# EasyEDA Pro project ESP32_wroom_A.eprj, board main
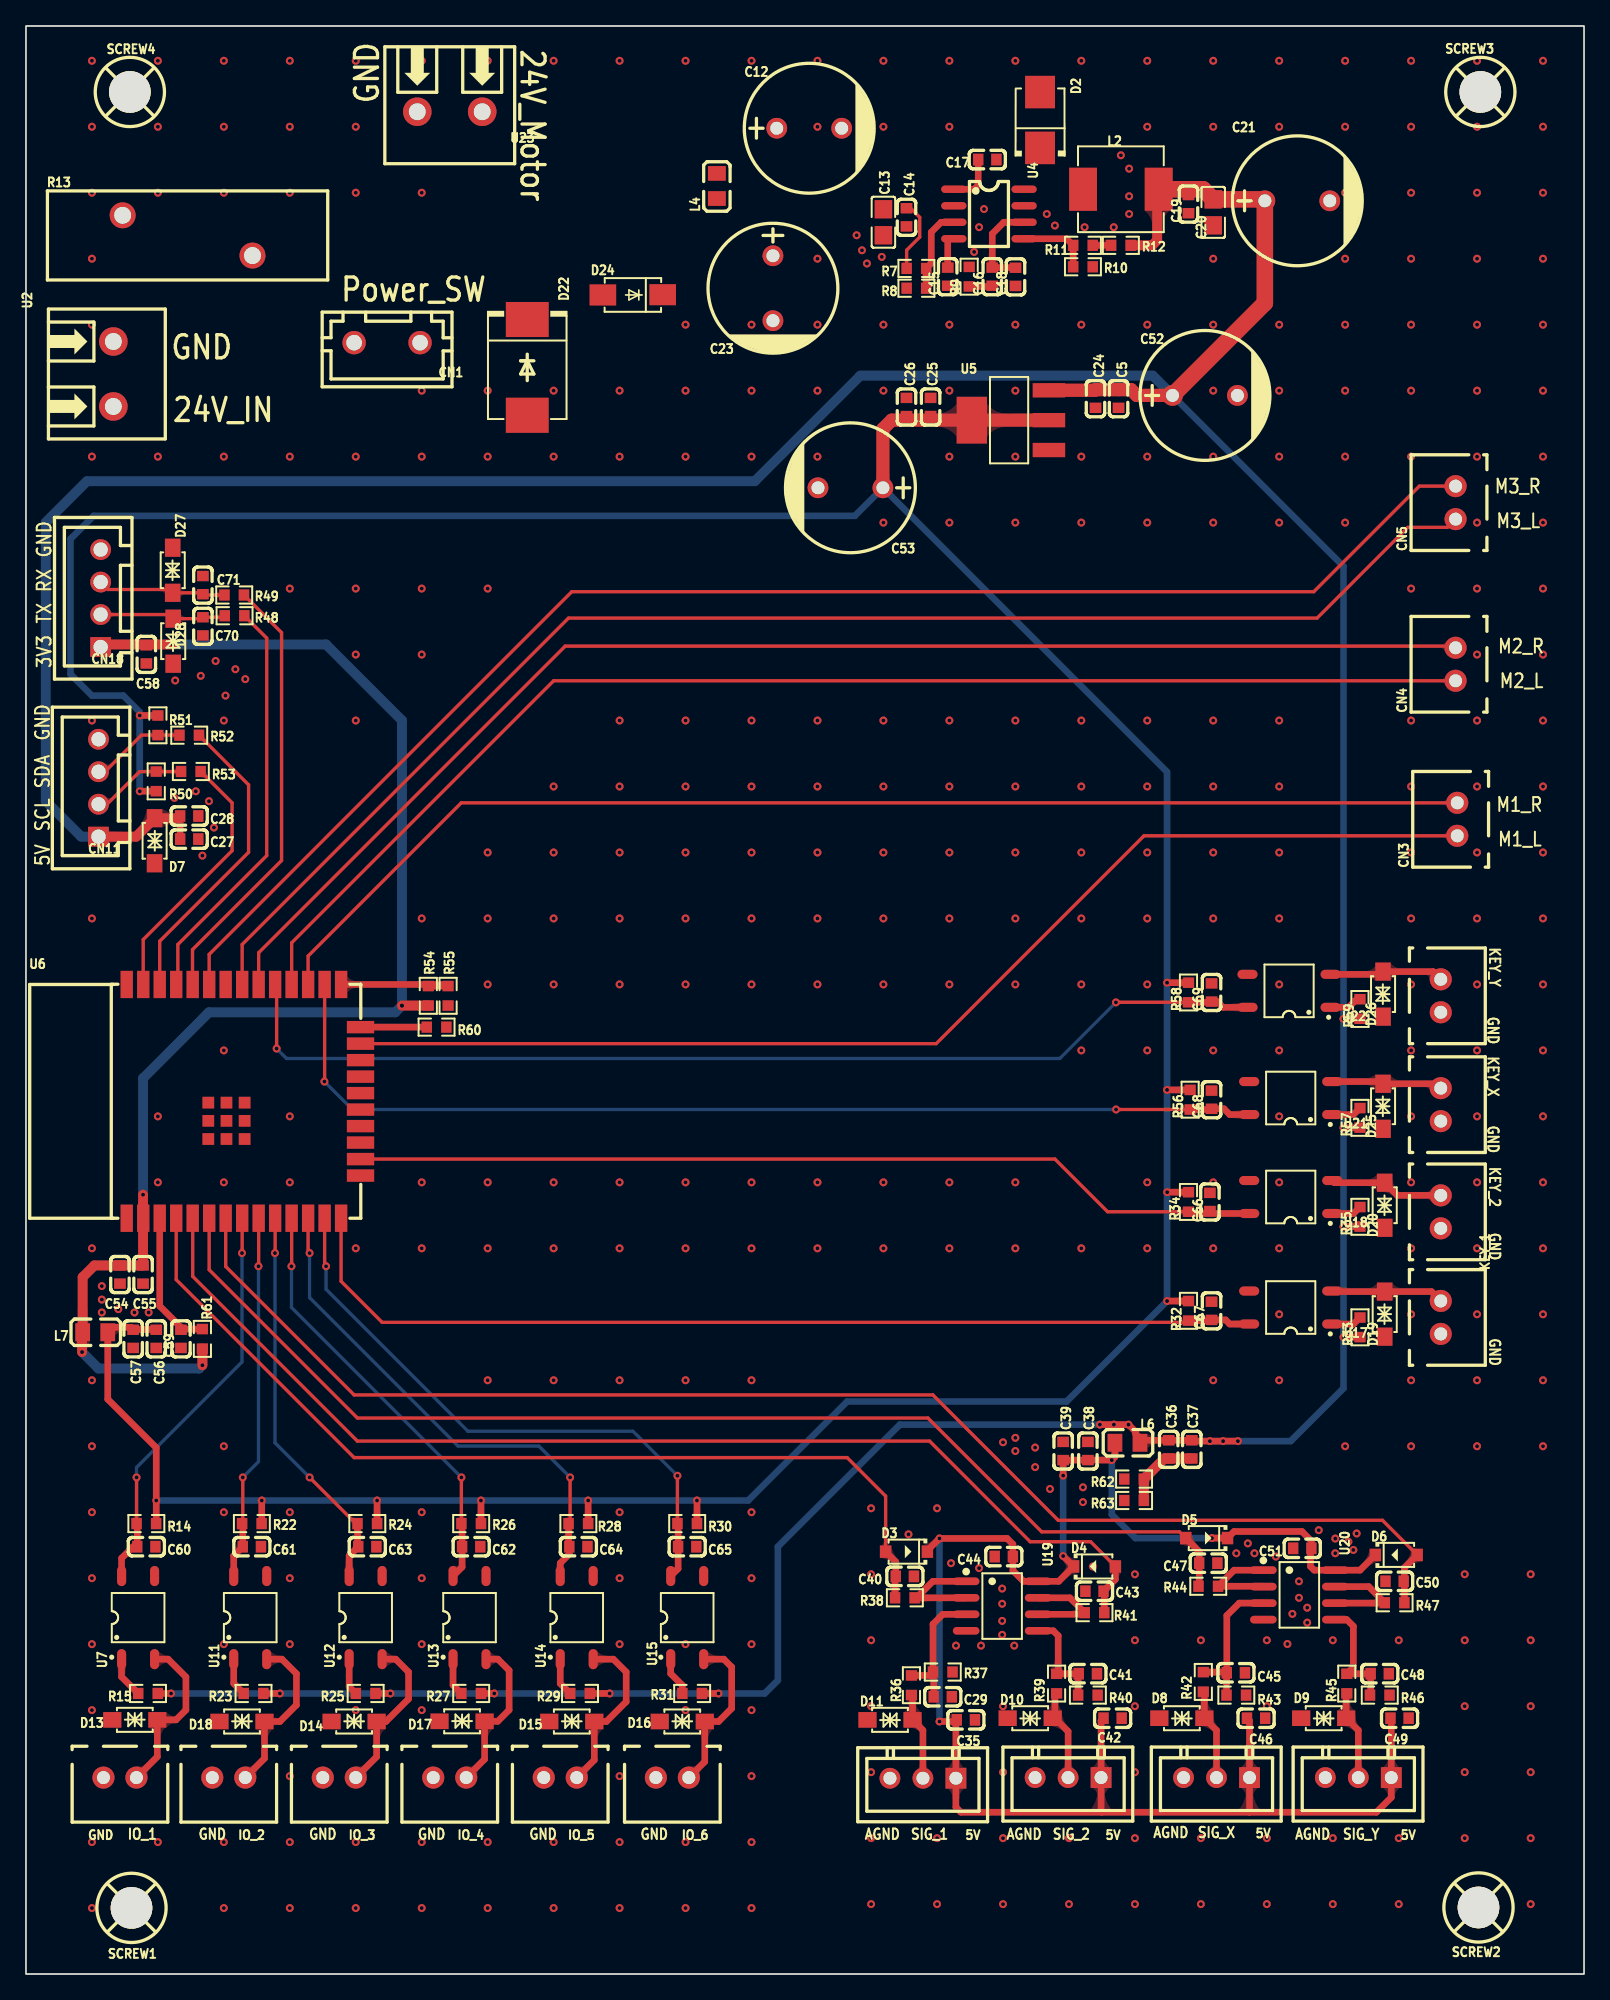
[diagram p1: board, top side]
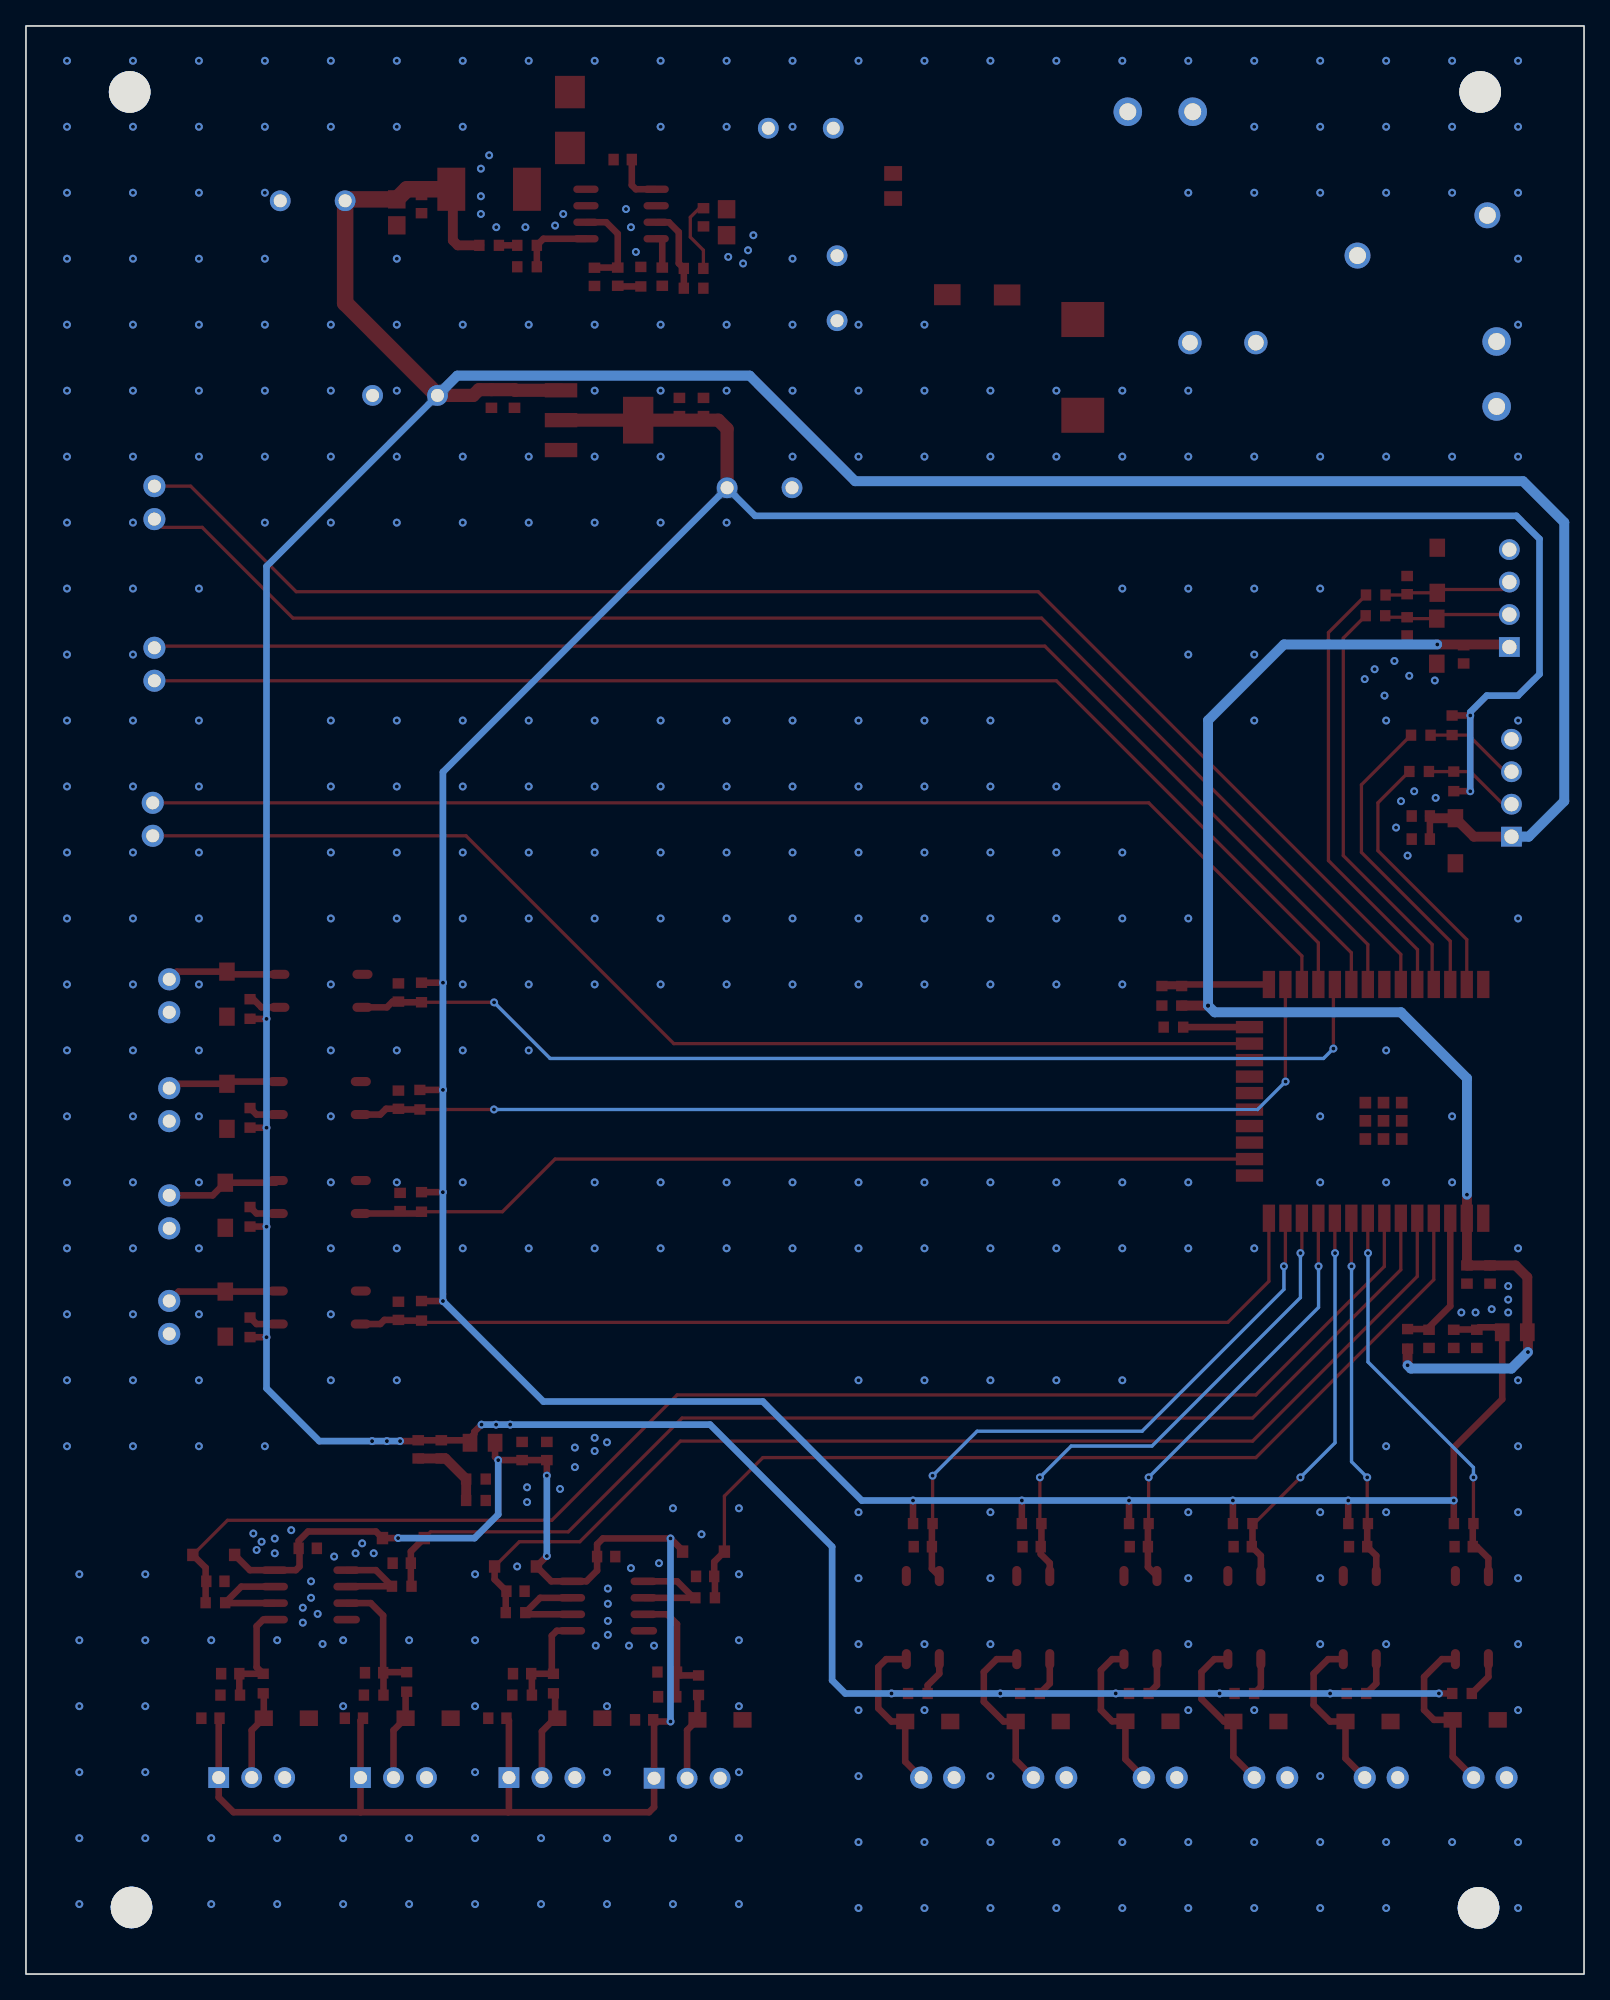
[diagram p2: board, bottom side, seen from below]

Outline 120 x 150 mm; copper layers: Top Layer, Bottom Layer. Coordinates in mm from the lower left corner of the outline.
Outline path: rectangle 0,150 120,0
Stack: Top Layer 0.035mm / Dielectric1 1.51mm FR4 er 4.5 / Bottom Layer 0.035mm

## Design rules (mm)
template: 自定义配置
spacing copperThickness1oz (default): track to track 0.254, other pairs 0 to 0.762
spacing copperThickness2oz: track to track 0.203, other pairs 0.152 to 0.3
track width copperThickness1oz (default): min 0.127, default 0.254, max 2.54
track width copperThickness2oz: min 0.203, default 0.254, max 2.54
differential pair differentialPair (default): width min 0.127, default 0.254, max 2.54; gap min 0.152, default 0.152
via viaSize (default): diameter min 0.5, default 0.61, max 10; hole min 0.3, default 0.305, max 6.299

## Placement (name value [footprint] x y rotation side)
5V  -  [CONN-TH_3P-P2.54_2501S-3P]  69.08 15.08 180 top
5V#2  -  [CONN-TH_3P-P2.54_2501S-3P]  80.26 15.13 180 top
5V#3  -  [CONN-TH_3P-P2.54_2501S-3P]  91.69 15.13 180 top
5V#4  -  [CONN-TH_3P-P2.54_2501S-3P]  102.62 15.13 180 top
C5  100nF  [C0603]  84.15 121.3 90 top
C12  470uF  [CAP-TH_BD10.0-P5.00-D0.6-FD-A]  60.33 142.13 0 top
C13  10uF  [C0805]  66.04 134.89 90 top
C14  100nF  [C0603]  67.82 135.27 90 top
C15  10nF  [C0603]  70.99 130.7 90 top
C16  1nF  [C0603]  74.42 130.7 90 top
C17  100nF  [C0603]  74.04 139.71 0 top
C18  100pF  [C0603]  76.21 130.68 90 top
C19  100nF  [C0603]  89.54 136.28 90 top
C20  10uF  [C0805]  91.44 135.65 90 top
C21  470uF  [CAP-TH_BD10.0-P5.00-D0.6-FD-A]  97.92 136.54 0 top
C23  470uF  [CAP-TH_BD10.0-P5.00-D0.6-FD-A]  57.53 129.81 270 top
C24  10uF  [C0603]  82.37 121.3 90 top
C25  100nF  [C0603]  69.67 120.66 270 top
C26  10uF  [C0603]  67.82 120.66 270 top
C27  100nF  [C0603]  12.57 87.39 180 top
C28  10uF  [C0603]  12.57 89.17 180 top
C29  100nF  [C0603]  70.61 21.35 180 top
C35  100nF  [C0603]  72.39 19.57 180 top
C36  100nF  [C0603]  88.01 40.4 90 top
C37  10uF  [C0603]  89.79 40.4 90 top
C38  100nF  [C0603]  81.79 40.27 270 top
C39  10uF  [C0603]  79.88 40.27 270 top
C40  100nF  [C0603]  67.69 30.62 180 top
C41  100nF  [C0603]  81.79 23.13 180 top
C42  100nF  [C0603]  83.69 19.7 180 top
C43  100nF  [C0603]  82.3 29.48 0 top
C44  100nF  [C0603]  75.31 32.14 0 top
C45  100nF  [C0603]  93.19 23.2 180 top
C46  100nF  [C0603]  94.74 19.7 180 top
C47  100nF  [C0603]  91.06 31.64 180 top
C48  100nF  [C0603]  104.27 23.13 180 top
C49  100nF  [C0603]  105.79 19.7 180 top
C50  100nF  [C0603]  105.41 30.24 0 top
C51  100nF  [C0603]  98.3 32.78 0 top
C52  220uF  [CAP-TH_BD10.0-P5.00-D0.6-FD-A]  90.8 121.55 0 top
C53  220uF  [CAP-TH_BD10.0-P5.00-D0.6-FD-A]  63.5 114.44 180 top
C54  4.7uF  [C0603]  7.24 53.86 90 top
C55  100nF  [C0603]  9.02 53.86 90 top
C56  100nF  [C0603]  10.03 48.91 90 top
C57  4.7uF  [C0603]  8.26 48.91 90 top
C58  100nF  [C0603]  9.27 101.61 270 top
C59  100nF  [C0603]  11.94 48.91 90 top
C60  100nF  [C0603]  9.27 32.91 180 top
C61  100nF  [C0603]  17.4 32.91 180 top
C62  100nF  [C0603]  34.29 32.91 180 top
C63  100nF  [C0603]  26.29 32.91 180 top
C64  100nF  [C0603]  42.55 32.91 180 top
C65  100nF  [C0603]  50.93 32.91 180 top
C66  100nF  [C0603]  91.19 59.45 270 top
C67  100nF  [C0603]  91.31 51.07 270 top
C68  100nF  [C0603]  91.31 67.32 270 top
C69  100nF  [C0603]  91.31 75.58 270 top
C70  N.C  [C0603]  13.63 103.77 90 top
C71  N.C  [C0603]  13.63 106.95 90 top
CN1  B2(3)B-XH-A(LF)(SN)  [CONN-TH_2P-V-P5.00-R_B2-3B-XH-A-LF-SN]  27.81 125.62 180 top
CN3  B2B-XH-A(LF)(SN)  [CONN-TH_B2B-XH-A-LF-SN]  110.24 88.91 90 top
CN4  B2B-XH-A(LF)(SN)  [CONN-TH_B2B-XH-A-LF-SN]  110.11 100.85 90 top
CN5  B2B-XH-A(LF)(SN)  [CONN-TH_B2B-XH-A-LF-SN]  110.11 113.3 90 top
CN11  ZX-XH2.54-4PZZ  [CONN-TH_4P-P2.50_4PIN]  5.59 91.33 90 top
CN13  B2B-XH-A(LF)(SN)  [CONN-TH_B2B-XH-A-LF-SN]  108.97 58.69 270 top
CN18  ZX-XH2.54-4PZZ  [CONN-TH_4P-P2.50_4PIN]  5.75 105.93 90 top
CN19  B2B-XH-A(LF)(SN)  [CONN-TH_B2B-XH-A-LF-SN]  108.97 66.94 270 top
CN20  B2B-XH-A(LF)(SN)  [CONN-TH_B2B-XH-A-LF-SN]  108.97 75.32 270 top
D2  SS1060B  [SMB_L4.3-W3.6-LS5.3-RD]  78.11 142.76 90 top
D3  1N4148W  [SOD-123_L2.7-W1.6-LS3.7-FD]  67.82 32.53 0 top
D4  1N4148W  [SOD-123_L2.7-W1.6-LS3.7-FD]  82.3 31.38 180 top
D5  1N4148W  [SOD-123_L2.7-W1.6-LS3.7-FD]  90.93 33.57 0 top
D6  1N4148W  [SOD-123_L2.7-W1.6-LS3.7-FD]  105.54 32.27 180 top
D7  SMF24CA  [SOD-123FL_L2.7-W1.8-LS3.8-BI]  9.91 87.26 90 top
D8  SMF24CA  [SOD-123FL_L2.7-W1.8-LS3.8-BI]  89.03 19.7 0 top
D9  SMF24CA  [SOD-123FL_L2.7-W1.8-LS3.8-BI]  99.95 19.7 0 top
D10  SMF24CA  [SOD-123FL_L2.7-W1.8-LS3.8-BI]  77.34 19.7 0 top
D11  SMF24CA  [SOD-123FL_L2.7-W1.8-LS3.8-BI]  66.55 19.57 0 top
D13  SMF24CA  [SOD-123FL_L2.7-W1.8-LS3.8-BI]  8.38 19.57 180 top
D14  SMF24CA  [SOD-123FL_L2.7-W1.8-LS3.8-BI]  25.27 19.44 180 top
D15  SMF24CA  [SOD-123FL_L2.7-W1.8-LS3.8-BI]  42.04 19.44 180 top
D16  SMF24CA  [SOD-123FL_L2.7-W1.8-LS3.8-BI]  50.55 19.44 180 top
D17  SMF24CA  [SOD-123FL_L2.7-W1.8-LS3.8-BI]  33.59 19.46 180 top
D18  SMF24CA  [SOD-123FL_L2.7-W1.8-LS3.8-BI]  16.64 19.44 180 top
D19  SMF24CA  [SOD-123FL_L2.7-W1.8-LS3.8-BI]  104.65 50.81 270 top
D20  SMF24CA  [SOD-123FL_L2.7-W1.8-LS3.8-BI]  104.65 59.2 270 top
D22  SMCJ24A  [SMC_L6.9-W5.9-LS7.9-RD]  38.61 123.71 270 top
D24  SS54  [SMA_L4.3-W2.6-LS5.0-FD]  46.74 129.3 0 top
D25  SMF24CA  [SOD-123FL_L2.7-W1.8-LS3.8-BI]  104.52 66.82 270 top
D26  SMF24CA  [SOD-123FL_L2.7-W1.8-LS3.8-BI]  104.52 75.45 270 top
D27  SMF24CA  [SOD-123FL_L2.7-W1.8-LS3.8-BI]  11.3 108.09 270 top
D28  SMF24CA  [SOD-123FL_L2.7-W1.8-LS3.8-BI]  11.34 102.63 270 top
GND  B2B-XH-A(LF)(SN)  [CONN-TH_B2B-XH-A-LF-SN]  7.24 15.13 180 top
IO_2  B2B-XH-A(LF)(SN)  [CONN-TH_B2B-XH-A-LF-SN]  15.62 15.13 180 top
IO_3  B2B-XH-A(LF)(SN)  [CONN-TH_B2B-XH-A-LF-SN]  24.13 15.13 180 top
IO_4  B2B-XH-A(LF)(SN)  [CONN-TH_B2B-XH-A-LF-SN]  32.64 15.13 180 top
IO_5  B2B-XH-A(LF)(SN)  [CONN-TH_B2B-XH-A-LF-SN]  41.15 15.13 180 top
IO_6  B2B-XH-A(LF)(SN)  [CONN-TH_B2B-XH-A-LF-SN]  49.78 15.13 180 top
KEY_1  B2B-XH-A(LF)(SN)  [CONN-TH_B2B-XH-A-LF-SN]  108.97 50.56 270 top
L2  10uH  [IND-SMD_L7.1-W6.6]  84.33 137.43 0 top
L4  GZ2012D101TF  [L0805]  53.21 137.68 90 top
L6  GZ2012D101TF  [L0805]  84.84 40.91 180 top
L7  GZ2012D101TF  [L0805]  5.33 49.42 180 top
R7  12kΩ  [R0603]  68.58 131.33 180 top
R8  2.7kΩ  [R0603]  68.58 129.81 0 top
R9  22kΩ  [R0603]  72.64 130.7 270 top
R10  2kΩ  [R0603]  81.41 131.46 180 top
R11  10kΩ  [R0603]  81.41 133.11 0 top
R12  510R  [R0603]  84.33 133.11 0 top
R13  1.05nF@1kHz  [RES-TH_L21.5-W6.8-P10.00-D1.0-S3.10]  12.45 133.87 0 top
R14  2kΩ  [R0603]  9.27 34.68 0 top
R15  680Ω  [R0603]  9.4 21.6 0 top
R22  2kΩ  [R0603]  17.4 34.68 0 top
R23  680Ω  [R0603]  17.53 21.6 0 top
R24  2kΩ  [R0603]  26.29 34.68 0 top
R25  680Ω  [R0603]  26.16 21.6 0 top
R26  2kΩ  [R0603]  34.29 34.68 0 top
R27  680Ω  [R0603]  34.29 21.6 0 top
R28  2kΩ  [R0603]  42.55 34.68 0 top
R29  680Ω  [R0603]  42.67 21.6 0 top
R30  2kΩ  [R0603]  50.93 34.68 0 top
R31  680Ω  [R0603]  51.31 21.6 0 top
R32  2kΩ  [R0603]  89.54 51.07 90 top
R33  680Ω  [R0603]  102.74 49.8 270 top
R34  2kΩ  [R0603]  89.54 59.45 90 top
R35  680Ω  [R0603]  102.74 58.31 270 top
R36  4.7kΩ  [R0603]  68.2 22.24 90 top
R37  10kΩ  [R0603]  70.61 23.25 180 top
R38  1kΩ  [R0603]  67.69 28.97 180 top
R39  4.7kΩ  [R0603]  79.38 22.37 90 top
R40  10kΩ  [R0603]  81.79 21.48 180 top
R41  1kΩ  [R0603]  82.3 27.83 0 top
R42  6.8kΩ  [R0603]  90.68 22.49 90 top
R43  10kΩ  [R0603]  93.22 21.48 180 top
R44  1kΩ  [R0603]  91.06 29.86 180 top
R45  6.8kΩ  [R0603]  101.73 22.37 90 top
R46  10kΩ  [R0603]  104.27 21.48 180 top
R47  1kΩ  [R0603]  105.41 28.59 0 top
R48  33Ω  [R0603]  16.06 104.59 180 top
R49  33Ω  [R0603]  16.04 106.19 180 top
R50  10kΩ  [R0603]  10.03 91.83 270 top
R51  10kΩ  [R0603]  10.16 96.15 90 top
R52  33Ω  [R0603]  12.57 95.39 180 top
R53  33Ω  [R0603]  12.7 92.6 180 top
R54  N.C  [R0603]  30.99 75.32 270 top
R55  N.C  [R0603]  32.51 75.32 90 top
R56  2kΩ  [R0603]  89.66 67.32 90 top
R57  680Ω  [R0603]  102.74 65.93 270 top
R58  2kΩ  [R0603]  89.54 75.58 90 top
R59  680Ω  [R0603]  102.74 74.31 270 top
R60  N.C  [R0603]  31.62 72.91 180 top
R61  10kΩ  [R0603]  13.59 48.91 270 top
R62  0Ω  [R0603]  85.34 38.11 180 top
R63  0Ω  [R0603]  85.34 36.46 180 top
SCREW1  -  [M3螺丝]  8.13 5.09 0 top
SCREW2  -  [M3螺丝]  111.87 5.12 0 top
SCREW3  -  [M3螺丝]  112.01 144.92 0 top
SCREW4  -  [M3螺丝]  8 144.92 0 top
U2  1935161  [CONN-TH_2P-P5.00_1935161]  6.73 123.2 270 top
U4  TPS54331DR  [SOIC-8_L5.0-W4.0-P1.27-LS6.0-BL]  74.17 135.52 270 top
U5  AMS1117-3.3  [SOT-223-3_L6.5-W3.4-P2.30-LS7.0-BR]  75.82 119.65 0 top
U6  ESP32-WROOM-32E-N4  [WIFI-SMD_ESP32-WROOM-32E]  16.76 67.2 0 top
U7  LTV-357T-C  [SOP-4_L4.4-W3.9-P2.54-LS7.0-TL]  8.64 27.45 90 top
U11  LTV-357T-C  [SOP-4_L4.4-W3.9-P2.54-LS7.0-TL]  17.27 27.45 90 top
U12  LTV-357T-C  [SOP-4_L4.4-W3.9-P2.54-LS7.0-TL]  26.16 27.45 90 top
U13  LTV-357T-C  [SOP-4_L4.4-W3.9-P2.54-LS7.0-TL]  34.16 27.45 90 top
U14  LTV-357T-C  [SOP-4_L4.4-W3.9-P2.54-LS7.0-TL]  42.42 27.45 90 top
U15  LTV-357T-C  [SOP-4_L4.4-W3.9-P2.54-LS7.0-TL]  50.93 27.45 90 top
U17  LTV-357T-C  [SOP-4_L4.4-W3.9-P2.54-LS7.0-TL]  97.41 51.32 180 top
U18  LTV-357T-C  [SOP-4_L4.4-W3.9-P2.54-LS7.0-TL]  97.41 59.83 180 top
U19  LM2904DR  [SOIC-8_L4.9-W3.9-P1.27-LS6.0-BL]  75.18 28.33 270 top
U20  LM2904DR  [SOIC-8_L4.9-W3.9-P1.27-LS6.0-BL]  98.07 29.19 270 top
U21  LTV-357T-C  [SOP-4_L4.4-W3.9-P2.54-LS7.0-TL]  97.41 67.45 180 top
U22  LTV-357T-C  [SOP-4_L4.4-W3.9-P2.54-LS7.0-TL]  97.28 75.71 180 top
U23  1935161  [CONN-TH_2P-P5.00_1935161]  32.64 143.4 180 top

## Footprints (pads in the part's own frame, mm; a bottom-side part is the same pattern mirrored in y, then rotated)
C0603
  rect 0.8x0.9 smd: 1(-0.7,0) 2(0.7,0)
C0805
  rect 1.41x1.35 smd: 1(-1,0) 2(1,0)
CAP-TH_BD10.0-P5.00-D0.6-FD-A
  round 1.6 hole 1: 1(-2.5,0) 2(2.5,0)
CONN-TH_2P-P5.00_1935161
  round 2.2 hole 1.3: 1(-2.5,0) 2(2.5,0)
CONN-TH_2P-V-P5.00-R_B2-3B-XH-A-LF-SN
  round 1.8 hole 1.2: 1(2.54,0) 2(-2.54,0)
CONN-TH_3P-P2.54_2501S-3P
  rect 1.6x1.6 hole 1: 1(-2.54,0)
  round 1.6 hole 1: 2(0,0) 3(2.54,0)
CONN-TH_4P-P2.50_4PIN
  rect 1.524x1.6 hole 1.1: 1(-3.75,0)
  round 1.6 hole 1.1: 2(-1.25,0) 3(1.25,0) 4(3.75,0)
CONN-TH_B2B-XH-A-LF-SN
  round 1.7 hole 1: 1(1.27,0) 2(-1.27,0)
IND-SMD_L7.1-W6.6
  rect 2.15x3.32 smd: 1(-2.913,0) 2(2.913,0)
L0805
  rect 1.133x1.377 smd: 1(-0.966,0) 2(0.966,0)
M3螺丝
  round 3.2 hole 3.2: 1(0,0)
R0603
  rect 0.806x0.864 smd: 1(-0.753,0) 2(0.753,0)
RES-TH_L21.5-W6.8-P10.00-D1.0-S3.10
  round 2 hole 1.3: 1(-5,1.55) 2(5,-1.55)
SMA_L4.3-W2.6-LS5.0-FD
  rect 2.046x1.62 smd: 1(-2.304,-0.009) 2(2.304,0.009)
SMB_L4.3-W3.6-LS5.3-RD
  rect 2.5x2.3 smd: 1(-2.15,0) 2(2.15,0)
SMC_L6.9-W5.9-LS7.9-RD
  rect 2.7x3.3 smd: 1(-3.687,0) 2(3.687,0)
SOD-123_L2.7-W1.6-LS3.7-FD
  rect 0.88x0.96 smd: 1(-1.61,0) 2(1.61,0)
SOD-123FL_L2.7-W1.8-LS3.8-BI
  rect 1.4x1.2 smd: 1(-1.735,0) 2(1.735,0)
SOIC-8_L4.9-W3.9-P1.27-LS6.0-BL
  oval 0.588x2.045 smd: 1(-1.905,-2.772) 2(-0.635,-2.772) 3(0.635,-2.772) 4(1.905,-2.772) 5(1.905,2.772) 6(0.635,2.772) 7(-0.635,2.772) 8(-1.905,2.772)
SOIC-8_L5.0-W4.0-P1.27-LS6.0-BL
  oval 0.569x1.95 smd: 1(-1.905,-2.705) 2(-0.635,-2.705) 3(0.635,-2.705) 4(1.905,-2.705) 5(1.905,2.705) 6(0.635,2.705) 7(-0.635,2.705) 8(-1.905,2.705)
SOP-4_L4.4-W3.9-P2.54-LS7.0-TL
  oval 1.55x0.7 smd: 1(-3.2,1.27) 2(-3.2,-1.27) 3(3.2,-1.27) 4(3.2,1.27)
SOT-223-3_L6.5-W3.4-P2.30-LS7.0-BR
  rect 2.5x1.1 smd: 1(2.97,-2.3) 2(2.97,0) 3(2.97,2.3)
  rect 2.34x3.6 smd: 4(-2.97,0)
WIFI-SMD_ESP32-WROOM-32E
  rect 0.95x2.1 smd: 1(-9.002,-9) 2(-7.732,-9) 3(-6.463,-9) 4(-5.192,-9) 5(-3.922,-9) 6(-2.652,-9) 7(-1.383,-9) 8(-0.113,-9) 9(1.157,-9) 10(2.428,-9) 11(3.697,-9) 12(4.968,-9) 13(6.237,-9) 14(7.508,-9) 25(7.508,9) 26(6.237,9) 27(4.968,9) 28(3.697,9) 29(2.428,9) 30(1.157,9) 31(-0.113,9) 32(-1.383,9) 33(-2.652,9) 34(-3.922,9) 35(-5.192,9) 36(-6.463,9) 37(-7.732,9) 38(-9.002,9)
  rect 2.1x0.95 smd: 15(9.002,-5.715) 16(9.002,-4.445) 17(9.002,-3.175) 18(9.002,-1.905) 19(9.002,-0.635) 20(9.002,0.635) 21(9.002,1.905) 22(9.002,3.175) 23(9.002,4.445) 24(9.002,5.715)
  rect 0.9x0.9 smd: 39(-2.721,-0.1) 39(-2.721,-1.5) 39(-2.721,-2.9) 39(-1.321,-0.1) 39(-1.321,-1.5) 39(-1.321,-2.9) 39(0.079,-0.1) 39(0.079,-1.5) 39(0.079,-2.9)

## Nets
As in the schematic, except:
AGND: 5V.3 5V#2.3 5V#3.3 5V#4.3 C29.1 C35.1 C38.1 C39.1 C40.1 C41.1 C42.1 C43.1 C44.1 C45.1 C46.1 C47.1 C48.1 C49.1 C50.1 C51.1 D8.1 D9.1 D10.1 D11.1 R37.1 R40.1 R43.1 R46.1 R62.2 R63.2 U19.4 U20.4
GND: C5.1 C12.2 C13.1 C14.1 C15.1 C18.1 C19.1 C20.1 C21.2 C23.2 C24.1 C25.1 C26.1 C27.1 C28.1 C36.1 C37.1 C52.2 C53.2 C54.1 C55.1 C56.1 C57.1 C58.2 C59.1 C60.1 C61.1 C62.1 C63.1 C64.1 C65.1 C66.1 C67.1 C68.1 C69.1 C70.1 C71.2 CN11.4 CN13.1 CN18.4 CN19.1 CN20.1 D2.2 D7.1 D13.2 D14.2 D15.2 D16.2 D17.2 D18.2 D19.2 D20.2 D22.2 D25.2 D26.2 D27.1 D28.2 GND.1 IO_2.1 IO_3.1 IO_4.1 IO_5.1 IO_6.1 KEY_1.1 R8.1 R9.1 R10.1 R13.1 R55.1 R60.1 R62.1 R63.1 U2.1 U4.7 U5.1 U6.1 U6.15 U6.38 U6.39 U7.3 U11.3 U12.3 U13.3 U14.3 U15.3 U17.3 U18.3 U21.3 U22.3 U23.2
A_5V: 5V.1 5V#2.1 5V#3.1 5V#4.1 C35.2 C38.2 C39.2 C42.2 C44.2 C46.2 C49.2 C51.2 D3.2 D4.2 D5.2 D6.2 L6.2 U19.8 U20.8
$1N8302: D13.1 GND.2 U7.2
$1N9716: D18.1 IO_2.2 U11.2
$1N9950: D14.1 IO_3.2 U12.2
$1N10184: D17.1 IO_4.2 U13.2
$1N10418: D15.1 IO_5.2 U14.2
$1N10652: D16.1 IO_6.2 U15.2
$1N11851: D19.1 KEY_1.2 U17.2
$1N12794: 5V.2 D11.2 R36.1
$1N14080: 5V#2.2 D10.2 R39.1
$1N15273: 5V#3.2 D8.2 R42.1
$1N15305: 5V#4.2 D9.2 R45.1

Pads without a net: SCREW1 1; SCREW2 1; SCREW3 1; SCREW4 1; U6 17 18 19 20 21 22 32

## Via types
v1: diameter 0.61, hole 0.305, Top Layer to Bottom Layer, 122 vias
v2: diameter 0.61, hole 0.304, Top Layer to Bottom Layer, 377 vias

## Routing (per net, layer and track width the routed paths; a pad name or vN(x,y) marks a point on that pad's centre or on a via; arc(x,y) is an arc through that point)
+3.3V: length 299.1
  Top Layer w0.508: R14.2 10.03,34.69 v1(10.03,36.46) 10.03,40.53 6.3,44.26 6.3,49.29 6.81,49.8 8.08,49.8 8.25,49.63 9.99,49.63 10.01,49.65 ; R22.2 18.16,34.69 v1(18.16,36.46) ; R26.2 v1(35.04,36.46) ; v1(8.76,91.07) 8.77,91.08 R50.2 ; R24.2 v1(27.04,36.46) ; R30.2 v1(51.68,36.46) ; R34.2 v1(87.89,60.2) 87.88,60.21 ; R28.2 v1(43.3,36.46) ; R56.2 v1(87.88,68.08) ; R58.2 v1(87.88,76.33) ; R32.2 v1(87.88,51.82) ; R51.2 v1(8.76,96.91)
  Top Layer w1.016: U5.2 U5.4 66.67,119.65 66,118.97 66,114.57
  Bottom Layer w0.508: v1(8.76,91.07) v1(8.76,96.91) 8.76,97.17 7.49,98.44 5.08,98.44 3.43,100.09 3.43,110.5 5.21,112.28 63.84,112.28 C53.1 87.88,92.56 v1(87.88,76.33) v1(87.88,68.08) v1(87.88,51.82) 80.15,44.08 63.25,44.08 55.63,36.46 v1(51.68,36.46) v1(43.3,36.46) v1(35.04,36.46) v1(27.04,36.46) v1(18.16,36.46) v1(10.03,36.46)
+3.3V_MCU: length 108.4
  Top Layer w0.762: v1(4.32,47.89) 4.32,49.37 L7.2 4.37,53.66 5.27,54.56 C54.2 C55.2 9.02,58.18 ; R54.2 v1(28.96,74.57) ; 9.02,58.18 U6.2 ; 9.02,58.18 v1(9.02,60.01) ; v1(13.59,46.88) R61.2 ; CN18.1 5.95,102.38 v1(11.3,102.38)
  Bottom Layer w0.762: v1(9.02,60.01) 9.02,68.97 14.1,74.05 28.45,74.05 v1(28.96,74.56) 28.96,96.53 23.11,102.38 v1(11.3,102.38) ; v1(13.59,46.88) 13.34,46.62 5.59,46.62 v1(4.32,47.89)
+5V: length 375.3
  Top Layer w0.508: R27.2 v1(36.07,21.6) ; R35.2 101.48,57.55 v1(101.47,57.54) ; R15.2 v1(11.18,21.6) ; C28.2 C27.2 ; R33.2 102.73,49.04 v1(101.47,49.04) ; 85.98,41.08 L6.1 ; 85.98,41.08 85.99,41.1 C36.2 C37.2 89.85,41.03 v1(91.19,41.03) v1(92.2,41.03) v1(93.35,41.03) ; 85.98,41.08 85.47,41.59 85.47,41.75 v1(84.92,42.3) v1(83.79,42.3) 82.88,42.3 ; R31.2 v1(53.34,21.6) ; R25.2 v1(28.07,21.6) ; R57.2 102.73,65.16 v1(101.47,65.16) ; v1(101.47,73.55) 102.48,73.55 102.62,73.68 ; R23.2 v1(19.56,21.6) ; 87.11,137.56 L2.2 ; R29.2 v1(44.96,21.6)
  Top Layer w0.762: CN11.1 8.48,87.58 D7.2 11.7,89 C28.2 ; R12.2 86.74,133.11 87.12,133.49 87.12,137.05
  Top Layer w1.016: U5.3 82.32,121.95 C24.2 C5.2 85.11,122 85.56,121.55 C52.1
  Top Layer w1.27: L2.2 90.66,137.43 C20.2 95.31,136.65 C21.1 95.42,128.66 C52.1
  Bottom Layer w0.508: 84.71,42.3 v1(83.79,42.3) v1(82.71,42.3) 67.31,42.3 57.91,32.91 57.91,22.62 56.9,21.6 v1(53.34,21.6) v1(44.96,21.6) v1(36.07,21.6) v1(28.07,21.6) v1(19.56,21.6) v1(11.18,21.6) ; v1(91.19,41.03) v1(92.2,41.03) v1(93.35,41.03) 97.41,41.03 101.47,45.1 v1(101.47,49.04) v1(101.47,57.54) v1(101.47,65.16) v1(101.47,73.55) 101.47,108.38 C52.1
  Bottom Layer w0.762: CN11.1 4.26,87.58 1.52,90.31 1.52,111.77 4.7,114.95 56.13,114.95 64.26,123.08 86.78,123.08 C52.1
AGND:
  vias: v1(67.97,33.86) v1(71.25,31.64) v1(71.63,25.29) v1(73.41,31.26) v1(73.56,25.29) v1(75.18,29.68) v1(75.18,28.51) v1(75.18,27.19) v1(75.18,26.12) v1(76.2,41.29) v1(76.2,40.27) v1(76.11,25.29) v1(77.72,40.54) v1(77.72,39.03) v1(78.87,37.35) v1(81.41,37.48) v1(81.41,36.34) v1(82.17,31.38) v1(93.22,32.4) v1(94.11,33.16) v1(94.61,32.4) v1(96.27,32.14) v1(97.16,25.41) v1(97.54,27.73) v1(98.04,30.24) v1(98.04,28.97) v1(98.68,28.21) v1(98.68,27.06) v1(99.57,34.18) v1(100.84,33.53) v1(100.84,32.4) v1(101.85,33.29) v1(102.23,32.65) v1(102.49,33.92) v2(65.09,35.86) v2(65.09,30.78) v2(65.09,25.7) v2(65.09,20.62) v2(65.09,15.54) v2(65.09,10.46) v2(65.09,5.38) v2(70.17,35.86) v2(70.17,10.46) v2(70.17,5.38) v2(75.25,40.94) v2(75.25,20.62) v2(75.25,15.54) v2(75.25,10.46) v2(75.25,5.38) v2(80.33,10.46) v2(80.33,5.38) v2(85.41,30.78) v2(85.41,25.7) v2(85.41,20.62) v2(85.41,15.54) v2(85.41,10.46) v2(85.41,5.38) v2(90.49,25.7) v2(90.49,10.46) v2(90.49,5.38) v2(95.57,25.7) v2(95.57,20.62) v2(95.57,10.46) v2(95.57,5.38) v2(100.65,25.7) v2(100.65,10.46) v2(100.65,5.38) v2(105.73,25.7) v2(105.73,10.46) v2(105.73,5.38) v2(110.81,30.78) v2(110.81,25.7) v2(110.81,20.62) v2(110.81,15.54) v2(110.81,10.46) v2(115.89,30.78) v2(115.89,25.7) v2(115.89,20.62) v2(115.89,15.54) v2(115.89,10.46) v2(115.89,5.38)
GND: length 6
  Top Layer w0.762: R63.1 R62.1 87.68,39.7 C36.1 C37.1
  vias: v1(5.84,52.97) v1(5.84,51.93) v1(5.84,50.94) v1(7.11,51.19) v1(8.36,50.94) v1(9.45,50.94) v1(11.49,99.6) v1(11.43,90.56) v1(13.08,91.07) v1(13.46,99.96) v1(13.59,86.12) v1(14.1,90.31) v1(14.48,88.28) v1(14.61,101.11) v1(15.37,98.44) v1(16.13,100.47) v1(16.89,99.71) v1(63.98,133.89) v1(64.39,132.73) v1(64.77,131.71) v1(65.91,132.22) v1(73.02,132.6) v1(73.41,134.51) v1(73.79,135.9) v1(78.62,135.52) v1(79.25,134.63) v1(81.53,134.51) v1(83.78,134.51) v1(84.33,140.04) v1(84.96,139.01) v1(84.96,136.89) v1(84.96,135.52) v2(5.08,147.32) v2(5.08,142.24) v2(5.08,137.16) v2(5.08,132.08) v2(5.08,127) v2(5.08,116.84) v2(5.08,96.52) v2(5.08,81.28) v2(5.08,55.88) v2(5.08,45.72) v2(5.08,40.64) v2(5.08,35.56) v2(5.08,30.48) v2(5.08,25.4) v2(5.08,20.32) v2(5.08,10.16) v2(5.08,5.08) v2(10.16,147.32) v2(10.16,142.24) v2(10.16,137.16) v2(10.16,116.84) v2(10.16,66.04) v2(10.16,60.96) v2(10.16,10.16) v2(15.24,147.32) v2(15.24,142.24) v2(15.24,137.16) v2(15.24,116.84) v2(15.24,96.52) v2(15.24,71.12) v2(15.24,60.96) v2(15.24,40.64) v2(15.24,35.56) v2(15.24,25.4) v2(15.24,10.16) v2(15.24,5.08) v2(20.32,147.32) v2(20.32,142.24) v2(20.32,137.16) v2(20.32,116.84) v2(20.32,106.68) v2(20.32,66.04) v2(20.32,60.96) v2(20.32,35.56) v2(20.32,30.48) v2(20.32,25.4) v2(20.32,15.24) v2(20.32,10.16) v2(20.32,5.08) v2(25.4,147.32) v2(25.4,142.24) v2(25.4,137.16) v2(25.4,116.84) v2(25.4,106.68) v2(25.4,101.6) v2(25.4,96.52) v2(25.4,55.88) v2(25.4,20.32) v2(25.4,10.16) v2(25.4,5.08) v2(30.48,147.32) v2(30.48,137.16) v2(30.48,121.92) v2(30.48,116.84) v2(30.48,106.68) v2(30.48,101.6) v2(30.48,81.28) v2(30.48,60.96) v2(30.48,55.88) v2(30.48,35.56) v2(30.48,30.48) v2(30.48,25.4) v2(30.48,20.32) v2(30.48,10.16) v2(30.48,5.08) v2(35.56,147.32) v2(35.56,121.92) v2(35.56,116.84) v2(35.56,106.68) v2(35.56,86.36) v2(35.56,81.28) v2(35.56,76.2) v2(35.56,60.96) v2(35.56,55.88) v2(35.56,45.72) v2(35.56,10.16) v2(35.56,5.08) v2(40.64,147.32) v2(40.64,121.92) v2(40.64,116.84) v2(40.64,91.44) v2(40.64,86.36) v2(40.64,81.28) v2(40.64,76.2) v2(40.64,60.96) v2(40.64,55.88) v2(40.64,45.72) v2(40.64,10.16) v2(40.64,5.08) v2(45.72,147.32) v2(45.72,121.92) v2(45.72,116.84) v2(45.72,96.52) v2(45.72,91.44) v2(45.72,86.36) v2(45.72,81.28) v2(45.72,76.2) v2(45.72,60.96) v2(45.72,55.88) v2(45.72,45.72) v2(45.72,35.56) v2(45.72,30.48) v2(45.72,25.4) v2(45.72,15.24) v2(45.72,10.16) v2(45.72,5.08) v2(50.8,147.32) v2(50.8,127) v2(50.8,121.92) v2(50.8,116.84) v2(50.8,96.52) v2(50.8,91.44) v2(50.8,86.36) v2(50.8,81.28) v2(50.8,76.2) v2(50.8,60.96) v2(50.8,55.88) v2(50.8,45.72) v2(50.8,25.4) v2(50.8,20.32) v2(50.8,10.16) v2(50.8,5.08) v2(55.88,147.32) v2(55.88,127) v2(55.88,121.92) v2(55.88,116.84) v2(55.88,96.52) v2(55.88,91.44) v2(55.88,86.36) v2(55.88,81.28) v2(55.88,76.2) v2(55.88,60.96) v2(55.88,55.88) v2(55.88,45.72) v2(55.88,35.56) v2(55.88,30.48) v2(55.88,25.4) v2(55.88,20.32) v2(55.88,15.24) v2(55.88,10.16) v2(55.88,5.08) v2(60.96,147.32) v2(60.96,142.24) v2(60.96,132.08) v2(60.96,127) v2(60.96,121.92) v2(60.96,116.84) v2(60.96,96.52) v2(60.96,91.44) v2(60.96,86.36) v2(60.96,81.28) v2(60.96,76.2) v2(60.96,60.96) v2(60.96,55.88) v2(66.04,147.32) v2(66.04,142.24) v2(66.04,127) v2(66.04,121.92) v2(66.04,111.76) v2(66.04,96.52) v2(66.04,91.44) v2(66.04,86.36) v2(66.04,81.28) v2(66.04,76.2) v2(66.04,60.96) v2(66.04,55.88) v2(71.12,147.32) v2(71.12,142.24) v2(71.12,127) v2(71.12,121.92) v2(71.12,116.84) v2(71.12,111.76) v2(71.12,96.52) v2(71.12,91.44) v2(71.12,86.36) v2(71.12,81.28) v2(71.12,76.2) v2(71.12,60.96) v2(71.12,55.88) v2(76.2,147.32) v2(76.2,127) v2(76.2,121.92) v2(76.2,116.84) v2(76.2,111.76) v2(76.2,96.52) v2(76.2,91.44) v2(76.2,86.36) v2(76.2,81.28) v2(76.2,76.2) v2(76.2,60.96) v2(76.2,55.88) v2(81.28,147.32) v2(81.28,127) v2(81.28,116.84) v2(81.28,111.76) v2(81.28,96.52) v2(81.28,91.44) v2(81.28,86.36) v2(81.28,81.28) v2(81.28,76.2) v2(81.28,71.12) v2(81.28,55.88) v2(86.36,147.32) v2(86.36,142.24) v2(86.36,127) v2(86.36,116.84) v2(86.36,111.76) v2(86.36,96.52) v2(86.36,91.44) v2(86.36,86.36) v2(86.36,81.28) v2(86.36,76.2) v2(86.36,71.12) v2(86.36,60.96) v2(86.36,55.88) v2(91.44,147.32) v2(91.44,142.24) v2(91.44,132.08) v2(91.44,127) v2(91.44,121.92) v2(91.44,116.84) v2(91.44,111.76) v2(91.44,96.52) v2(91.44,91.44) v2(91.44,86.36) v2(91.44,81.28) v2(91.44,71.12) v2(91.44,60.96) v2(91.44,55.88) v2(91.44,45.72) v2(96.52,147.32) v2(96.52,142.24) v2(96.52,127) v2(96.52,121.92) v2(96.52,116.84) v2(96.52,111.76) v2(96.52,96.52) v2(96.52,91.44) v2(96.52,86.36) v2(96.52,81.28) v2(96.52,76.2) v2(96.52,71.12) v2(96.52,66.04) v2(96.52,60.96) v2(96.52,55.88) v2(96.52,50.8) v2(96.52,45.72) v2(101.6,147.32) v2(101.6,142.24) v2(101.6,137.16) v2(101.6,132.08) v2(101.6,127) v2(101.6,121.92) v2(101.6,116.84) v2(101.6,111.76) v2(101.6,40.64) v2(106.68,147.32) v2(106.68,142.24) v2(106.68,137.16) v2(106.68,132.08) v2(106.68,127) v2(106.68,121.92) v2(106.68,116.84) v2(106.68,106.68) v2(106.68,96.52) v2(106.68,91.44) v2(106.68,86.36) v2(106.68,81.28) v2(106.68,76.2) v2(106.68,71.12) v2(106.68,66.04) v2(106.68,60.96) v2(106.68,55.88) v2(106.68,50.8) v2(106.68,45.72) v2(106.68,40.64) v2(111.76,147.32) v2(111.76,142.24) v2(111.76,137.16) v2(111.76,132.08) v2(111.76,127) v2(111.76,121.92) v2(111.76,116.84) v2(111.76,111.76) v2(111.76,106.68) v2(111.76,101.6) v2(111.76,96.52) v2(111.76,91.44) v2(111.76,86.36) v2(111.76,81.28) v2(111.76,76.2) v2(111.76,71.12) v2(111.76,66.04) v2(111.76,60.96) v2(111.76,55.88) v2(111.76,50.8) v2(111.76,45.72) v2(111.76,40.64) v2(116.84,147.32) v2(116.84,142.24) v2(116.84,137.16) v2(116.84,132.08) v2(116.84,127) v2(116.84,121.92) v2(116.84,116.84) v2(116.84,111.76) v2(116.84,106.68) v2(116.84,101.6) v2(116.84,96.52) v2(116.84,91.44) v2(116.84,86.36) v2(116.84,81.28) v2(116.84,76.2) v2(116.84,71.12) v2(116.84,66.04) v2(116.84,60.96) v2(116.84,55.88) v2(116.84,50.8) v2(116.84,45.72) v2(116.84,40.64)
A_5V: length 134
  Top Layer w0.508: 71.62,19.5 71.56,19.44 v1(70.36,19.44) ; 71.62,19.5 5V.1 71.62,12.85 72.01,12.46 82.86,12.46 ; 71.62,19.5 C35.2 ; 82.86,12.46 82.8,12.52 5V#2.1 82.8,19.51 C42.2 ; 82.86,12.46 94.23,12.46 ; 94.23,12.46 5V#3.1 94.23,19.51 C46.2 ; 94.23,12.46 104.01,12.46 105.16,13.6 5V#4.1 105.16,19.63 105.09,19.7 ; v1(79.88,38.38) 79.88,39.57 v1(83.63,39.57) 83.87,39.81 L6.2 ; v1(79.88,32.19) D4.2 79.54,30.24 U19.8 76.83,30.24 76.01,31.06 C44.2 76.01,33.09 75.57,33.54 v1(70.36,33.54) 69.43,32.61 D3.2 ; D6.2 102.75,31.1 U20.8 99.22,31.1 98.93,31.38 98.93,32.71 C51.2 99,33.35 98.27,34.08 93.05,34.08 D5.2 v1(91.34,33.57) 91.31,33.54
  Bottom Layer w0.508: v1(91.34,33.57) 85.44,33.57 83.63,35.38 v1(83.63,39.57) ; v1(79.88,38.38) v1(79.88,32.19) ; v1(70.36,19.44) v1(70.36,33.54)
IO1: length 31.6
  Top Layer w0.254: v1(16.64,55.51) 16.65,55.53 U6.8 ; R14.1 v1(8.52,38.24)
  Top Layer w0.508: U7.4 7.37,32.02 8.26,32.91 C60.2 8.57,34.63 R14.1
  Bottom Layer w0.254: v1(16.64,55.51) 16.64,47.13 8.52,39.01 v1(8.52,38.24)
IO2: length 28.4
  Top Layer w0.254: v1(17.91,54.5) 17.92,54.51 U6.9 ; 16.7,34.63 v1(16.7,38.24)
  Top Layer w0.508: R22.1 16.7,34.63 C61.2 16,32.21 U11.4
  Bottom Layer w0.254: v1(16.7,38.24) 17.91,39.45 v1(17.91,54.5)
IO3: length 30.6
  Top Layer w0.254: U6.10 19.19,55.53 v1(19.18,55.51) ; R24.1 25.4,34.68 v1(21.84,38.24)
  Top Layer w0.508: R24.1 25.54,32.96 C63.2 24.89,32.21 U12.4
  Bottom Layer w0.254: v1(19.18,55.51) 19.18,40.91 v1(21.84,38.24)
IO4: length 33.3
  Top Layer w0.254: U6.11 20.46,54.51 v1(20.45,54.5) ; R26.1 v1(33.54,38.24)
  Top Layer w0.508: U13.4 33.59,31.34 C62.2 33.59,34.63 R26.1
  Bottom Layer w0.254: v1(20.45,54.5) 20.45,51.33 v1(33.54,38.24)
IO5: length 39.9
  Top Layer w0.254: v1(41.91,38.24) 41.91,34.8 R28.1 ; v1(21.84,55.51) 21.73,55.62 U6.12
  Top Layer w0.508: R28.1 41.79,32.96 C64.2 41.85,32.33 41.15,31.64 U14.4
  Bottom Layer w0.254: v1(41.91,38.24) 39.5,40.65 33.27,40.65 21.84,52.08 v1(21.84,55.51)
IO6: length 46.5
  Top Layer w0.254: v1(23.11,54.5) 23,54.61 U6.13 ; v1(50.17,38.37) R30.1
  Top Layer w0.508: U15.4 50.23,31.22 C65.2 50.23,34.63 R30.1
  Bottom Layer w0.254: v1(23.11,54.5) 23.11,52.72 34.04,41.8 46.74,41.8 v1(50.17,38.37)
KEY1: length 76.3
  Top Layer w0.254: R32.1 89.4,50.18 27.43,50.18 24.27,53.34 U6.14
  Top Layer w0.508: U17.4 92.71,50.05 92.39,50.37 C67.2 91.26,50.31 R32.1
KEY2: length 70.2
  Top Layer w0.254: U6.16 79.25,62.75 83.3,58.7 R34.1
  Top Layer w0.508: U18.4 89.67,58.56 R34.1
PWM_M1_L: length 91.1
  Top Layer w0.254: CN3.2 86.11,87.64 70.1,71.64 U6.23
PWM_M1_R: length 95.6
  Top Layer w0.254: U6.27 21.73,78.39 33.53,90.18 CN3.1
PWM_M2_L: length 101.2
  Top Layer w0.254: U6.28 20.46,79.4 40.64,99.58 CN4.2
PWM_M2_R: length 104.5
  Top Layer w0.254: CN4.1 109.98,102.25 41.53,102.25 17.92,78.64 U6.30
PWM_M3_L: length 110.1
  Top Layer w0.254: CN5.2 109.47,111.39 106.43,111.39 99.44,104.41 41.78,104.41 16.65,79.28 U6.31
PWM_M3_R: length 113.2
  Top Layer w0.254: CN5.1 107.32,114.57 99.19,106.44 42.04,106.44 14.11,78.51 U6.33
RXD: length 9.7
  Top Layer w0.254: 11.09,106.36 10.83,106.61 6.32,106.61 CN18.3 ; D27.2 13.52,106.36 C71.1 13.69,106.19 R49.2
S_ADC1: length 74.4
  Top Layer w0.254: U6.4 11.57,53.47 25.27,39.76 63.25,39.76 66.21,36.8 D3.1
  Top Layer w0.508: D3.1 66.99,31.74 66.99,30.62 66.94,30.57 R38.2
S_ADC2: length 88.7
  Top Layer w0.254: D4.1 82,33.29 77.34,33.29 69.6,41.03 25.53,41.03 12.84,53.72 U6.5
  Top Layer w0.508: D4.1 83.91,30.39 C43.2 83.05,29.42 R41.2
S_ADC_X: length 91.9
  Top Layer w0.254: U6.6 14.11,54.23 25.53,42.81 69.47,42.81 78.23,34.05 88.84,34.05 D5.1
  Top Layer w0.508: D5.1 90.36,32.53 90.36,29.91 R44.2
S_ADC_Y: length 108.8
  Top Layer w0.254: D6.1 104.48,34.94 79.5,34.94 69.85,44.59 25.27,44.59 15.38,54.48 U6.7
  Top Layer w0.508: 106.16,30.19 106.16,31.29 D6.1 ; 106.16,30.19 R47.2 ; 106.16,30.19 C50.2
SCL: length 8
  Top Layer w0.254: CN11.2 6.24,90.08 8.75,92.59 R50.1 11.69,92.59 ; 11.69,92.59 11.95,92.59 11.95,92.84 11.69,92.59
SDA: length 7.4
  Top Layer w0.254: R52.2 11.81,95.4 R51.1 8.9,95.4 6.08,92.58 CN11.3
TXD: length 9.8
  Top Layer w0.254: CN18.2 11.02,104.68 D28.1 13.52,104.36 C70.2 15.19,104.47 15.31,104.59
X_KEY: length 79.8
  Top Layer w0.254: U6.26 23,68.73 v1(22.99,68.72) ; 83.95,66.56 v1(83.96,66.57) R56.1
  Top Layer w0.508: 94.21,66.18 92.71,66.18 92.27,66.62 C68.2 91.26,66.57 R56.1
  Bottom Layer w0.254: v1(83.96,66.57) 25.14,66.57 v1(22.99,68.72)
Y_KEY: length 82.1
  Top Layer w0.254: v1(83.95,74.82) 83.96,74.82 R58.1 ; U6.29 19.3,76.08 v1(19.3,71.26)
  Top Layer w0.508: U22.4 92.2,74.44 91.76,74.88 C69.2 91.26,74.82 R58.1
  Bottom Layer w0.254: v1(83.95,74.82) 79.63,70.5 20.07,70.5 v1(19.3,71.26)
$1N2189: length 6.5
  Top Layer w0.508: U4.3 70.48,134.89 69.72,134.12 69.72,131.72 R7.1 R8.2
$1N2195: length 2.7
  Top Layer w0.508: 70.99,131.4 70.99,133.62 U4.4
$1N2200: length 4
  Top Layer w0.508: C17.1 73.34,137.74 73.02,137.43 U4.1
$1N2211: length 1.8
  Top Layer w0.508: C16.1 74.37,129.94 R9.2
$1N2213: length 7.2
  Top Layer w0.508: C18.2 76.2,131.4 74.42,131.4 74.42,134 75.31,134.89 U4.6
$1N2217: length 5.6
  Top Layer w0.508: R10.2 R11.1 80.15,133.62 U4.5
$1N2224: length 1.4
  Top Layer w0.508: R11.2 R12.1
$1N6170: length 5.7
  Top Layer w0.254: R7.2 67.83,132.74 68.83,133.74 68.83,135.27 68.13,135.97 C14.2
$1N8286: length 3.2
  Top Layer w0.508: R15.1 7.37,22.88 U7.1
$1N8302: length 13.1
  Top Layer w0.508: GND.2 10.12,16.73 D13.1 11.56,19.57 12.32,20.33 12.32,22.87 10.95,24.25 U7.2
$1N9712: length 3
  Top Layer w0.508: R23.1 16,22.37 U11.1
$1N9716: length 13.1
  Top Layer w0.508: U11.2 19.71,24.25 20.83,23.13 20.83,20.71 19.56,19.44 D18.1 18.37,16.61 IO_2.2
$1N9946: length 2.9
  Top Layer w0.508: U12.1 24.89,22.12 R25.1
$1N9950: length 12.7
  Top Layer w0.508: U12.2 28.47,24.25 29.46,23.25 29.46,21.18 27.73,19.44 D14.1 27.01,16.73 IO_3.2
$1N10180: length 2.9
  Top Layer w0.508: R27.1 32.89,22.25 U13.1
$1N10184: length 12.4
  Top Layer w0.508: IO_4.2 35.32,16.54 D17.1 36.34,19.46 37.21,20.33 37.21,23.38 36.35,24.25 U13.2
$1N10414: length 3
  Top Layer w0.508: U14.1 41.15,22.37 R29.1
$1N10418: length 13.2
  Top Layer w0.508: IO_5.2 43.77,16.48 D15.1 44.7,19.44 46.23,20.97 46.23,23.25 45.24,24.25 U14.2
$1N10648: length 3
  Top Layer w0.508: U15.1 49.66,23.13 50.55,22.23 R31.1
$1N10652: length 12.9
  Top Layer w0.508: U15.2 53.75,24.25 54.36,23.64 54.36,20.46 53.34,19.44 D16.1 52.28,16.35 IO_6.2
$1N11847: length 2.3
  Top Layer w0.508: R33.1 102.24,50.05 U17.1
$1N11851: length 8.7
  Top Layer w0.508: KEY_1.2 108.25,52.55 D19.1 100.65,52.55 U17.2
$1N12081: length 2.3
  Top Layer w0.508: R35.1 102.24,58.56 U18.1
$1N12085: length 8.8
  Top Layer w0.508: U18.2 100.78,60.93 D20.1 105.62,59.96 CN13.2
$1N12741: length 10.3
  Top Layer w0.508: R36.2 69.6,22.99 R37.2 ; R37.2 69.91,23.2 C29.2 ; R37.2 69.86,26.95 70.61,27.7 U19.3
$1N12794: length 6.8
  Top Layer w0.508: R36.1 68.28,21.4 68.28,19.57 69.08,18.77 69.08,15.08
$1N13662: length 8.3
  Top Layer w0.508: U19.2 68.58,28.97 ; 68.58,28.97 69.85,30.24 U19.1 ; 68.58,28.97 R38.1
$1N14073: length 7.9
  Top Layer w0.508: R40.2 81.03,23.07 81.08,23.12 ; 81.08,23.12 79.5,23.12 79.5,26.05 79.12,26.43 U19.5 ; 81.08,23.12 C41.2
$1N14080: length 7.3
  Top Layer w0.508: 79.16,19.78 80.26,18.68 5V#2.2 ; 79.16,19.78 79.25,19.87 79.25,21.61 ; 79.16,19.78 D10.2 ; 79.16,19.78 78.99,19.95
$1N14257: length 7.7
  Top Layer w0.508: U19.6 81.42,27.7 R41.1 80.4,28.97 U19.7
$1N15266: length 11.2
  Top Layer w0.508: R42.2 92.44,23.25 C45.2 ; C45.2 92.49,27.6 93.44,28.56 U20.3 ; C45.2 92.46,23.17 R43.2
$1N15273: length 7
  Top Layer w0.508: 5V#3.2 91.69,18.77 D8.2 90.76,21.65 R42.1
$1N15283: length 7.5
  Top Layer w0.508: U20.2 95.27,29.86 R44.1 93.05,31.1 U20.1
$1N15298: length 9
  Top Layer w0.508: R46.2 103.57,21.53 103.57,23.13 103.56,23.12 R45.2 102.23,23.63 102.23,26.78 101.73,27.29 U20.5
$1N15305: length 6.9
  Top Layer w0.508: 5V#4.2 102.62,18.77 D9.2 101.68,21.57 R45.1
$1N15324: length 8.1
  Top Layer w0.508: U20.6 104.63,28.56 R47.1 103.42,29.83 U20.7
$1N39408: length 32
  Top Layer w0.254: U6.35 11.7,76.32 11.7,79.28 18.54,86.12 18.54,102.87 R48.1
$1N39500: length 34
  Top Layer w0.254: R49.1 19.69,103.29 19.69,85.74 12.83,78.88 12.83,76.21 U6.34
$1N39750: length 23.6
  Top Layer w0.254: R52.1 17.15,91.57 17.15,86.37 10.3,79.53 U6.36
$1N39795: length 20.5
  Top Layer w0.254: 13.2,92.6 13.46,92.6 15.88,90.18 15.88,86.5 9.03,79.66 U6.37
$1N39849: length 9.8
  Top Layer w0.508: U6.25 32.5,76.2 32.38,76.08 R54.1
$1N40491: length 8.7
  Top Layer w0.508: D26.1 108.37,77.19 CN20.2 ; U22.2 104.48,76.98 104.52,76.93
$1N40492: length 2.5
  Top Layer w0.508: 101.86,74.44 101.87,74.44 ; 101.87,74.44 102.62,75.19 ; 101.87,74.44 100.48,74.44 U22.1
$1N40496: length 8.6
  Top Layer w0.508: CN19.2 108.63,68.55 D25.1 104.35,68.72 U21.2
$1N40497: length 2.3
  Top Layer w0.508: R57.1 102.24,66.18 100.61,66.18
$1N40526: length 5.1
  Top Layer w0.508: U6.24 R60.2
$1N50711: length 10.8
  Top Layer w0.508: U6.3 10.3,51.43 12.07,49.66 R61.1

## Copper pours and planes (outline as drawn; the poured copper is in the pictures)
+24V_MOTOR on Top Layer: 32.89,145.79 46.1,145.79 46.1,122.97 29.02,122.97 29.02,132.92 32.89,136.79
AGND on Top Layer: 60.3,42.83 60.07,43.07 60.07,0 120,0 120,35.08 119.76,35.32 85.5,35.32 85.37,35.19 85.37,42.83
AGND on Bottom Layer: 60.32,42.84 60.09,43.08 60.09,0.01 120.02,0.01 120.02,35.09 119.78,35.33 85.51,35.33 85.39,35.21 85.39,42.84
GND on Top Layer: 0,150 120,150 120,36.44 87.44,36.44 87.44,44.56 87.39,44.61 87.39,45.72 87.38,45.73 56.9,45.73 56.77,45.86 56.77,0 0,0
GND on Bottom Layer: 0,150 120,150 120,36.53 87.56,36.53 87.5,36.59 87.5,45.79 56.83,45.79 56.77,45.73 56.77,0 0.01,0 0,0.01
VIN_24V on Top Layer: 26.92,135.52 26.92,118 3.23,118 3.23,123.2 10.67,123.2 10.67,135.52
$1N2202 on Top Layer: 74.16,142.2 83.06,142.2 83.06,135.23 79.66,135.23 79.66,136 78.66,137 74.17,137 74.16,137.04
$1N6170 on Top Layer: 51.44,139.97 65.28,139.97 68.71,136.54 72.52,136.54 72.52,135.78 69.01,135.78 69.01,135.52 67.31,135.52 66.93,135.14 65.28,135.14 62.61,137.81 51.44,137.81
$1N6170 on Top Layer: 51.44,143.9 59.56,143.9 59.56,137.94 59.44,137.81 51.44,137.81
$1N6171 on Top Layer: 47.88,137.43 58.67,137.43 58.67,129.43 58.55,129.3 53.72,129.3 52.58,128.16 47.88,128.16

Small or netless copper shapes (teardrops, artwork), in the pictures only: 239 on Top Layer, 24 on Bottom Layer

## Text on the board
Top Silkscreen Layer: GND | KEY_X | KEY_Y | KEY_2 | IO_1 | AGND | SIG_1 | SIG_2 | SIG_X | SIG_Y | SDA | SCL | 5V | RX | TX | 3V3 | M3_R | M3_L | M1_R | M2_R | M1_L | M2_L | 24V_IN | Power_SW | 24V_Motor
